# Altium schematic sheet cameralink.SchDoc
size A4; SheetNumber: 2; SheetTotal: 4
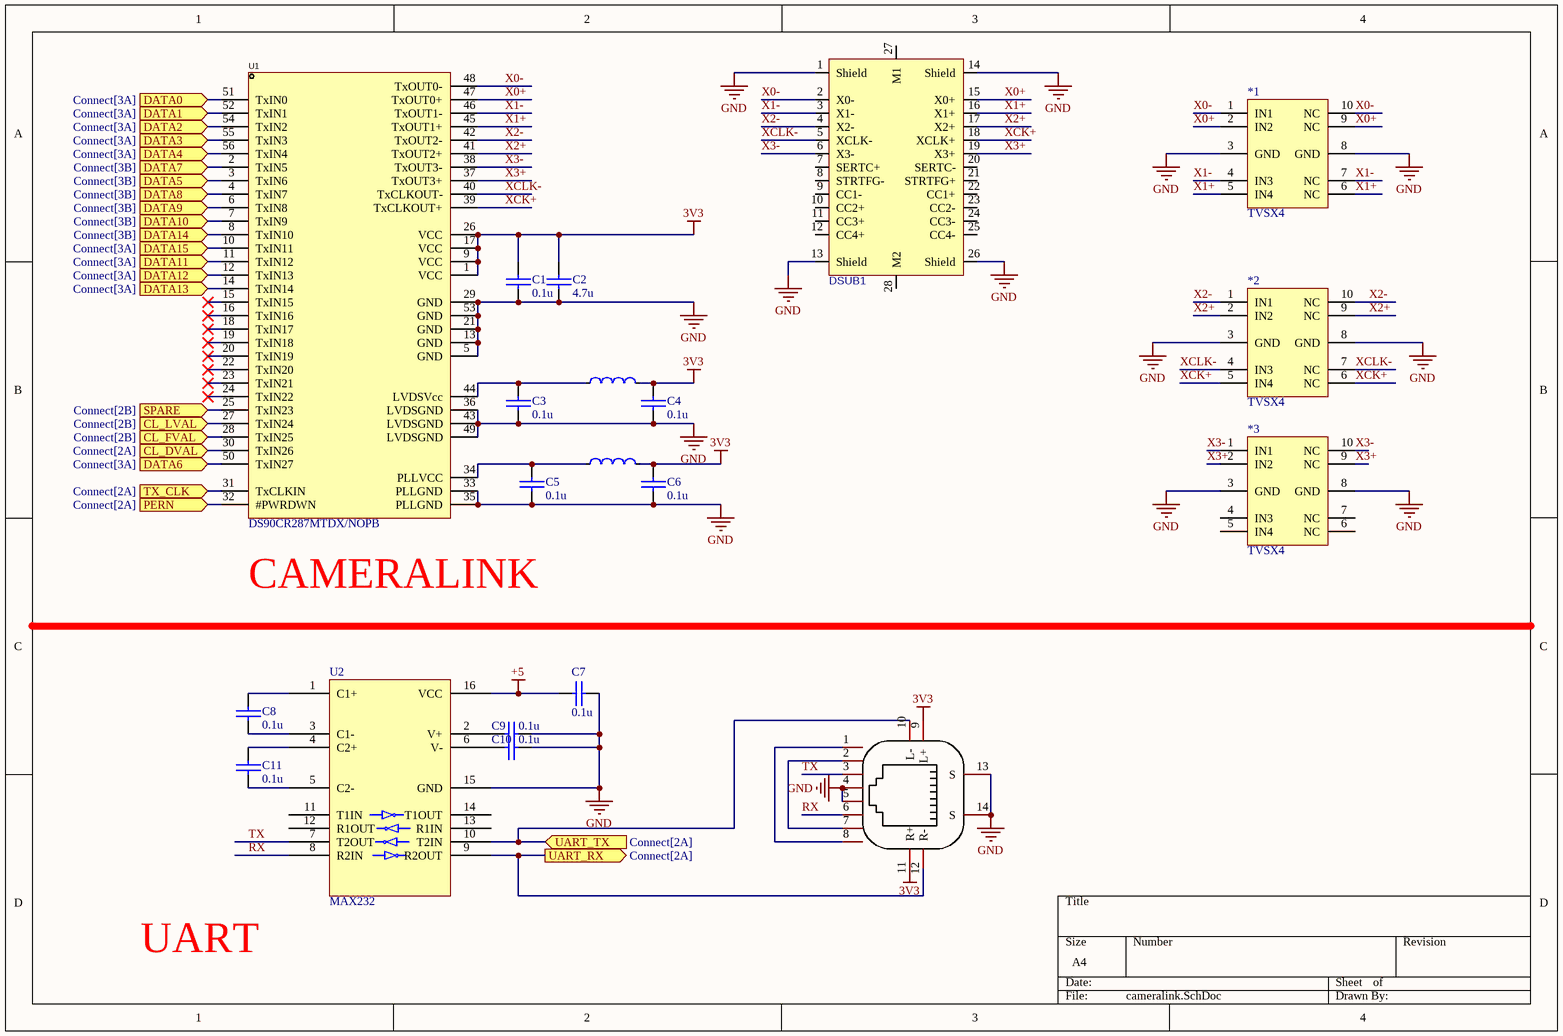
[diagram p0: cameralink.SchDoc]

## Parts
*1  TVSX4  [DFN-10]
*2  TVSX4  [DFN-10]
*3  TVSX4  [DFN-10]
C1  0.1u  [0603C]
C2  4.7u  [0603C]
C3  0.1u  [0603C]
C4  0.1u  [0603C]
C5  0.1u  [0603C]
C6  0.1u  [0603C]
C7  0.1u  [0603C]
C8  0.1u  [0603C]
C9  0.1u  [0603C]
C10  0.1u  [0603C]
C11  0.1u  [0603C]
DSUB1  6321-026RDS1MWA02  [MDR-26-horizontal]  (value not drawn)
L1  GZ1608D601TF  [0603L]  (value not drawn)
L2  GZ1608D601TF  [0603L]  (value not drawn)
RJ1  R-RJ45R08P-C000  [RJ45-TH_R-RJ45R08P-C000]  (value not drawn)
U1  DS90CR287MTDX/NOPB  [TSSOP-56_L14.0-W6.1-P0.50-LS8.1-BL]
U2  MAX232  [SOP16]

## Ports
CL_DVAL (in, see Connect[2A]), CL_FVAL (in, see Connect[2B]), CL_LVAL (in, see Connect[2B]), DATA0 (in, see Connect[3A]), DATA1 (in, see Connect[3A]), DATA2 (in, see Connect[3A]), DATA3 (in, see Connect[3A]), DATA4 (in, see Connect[3A]), DATA5 (in, see Connect[3B]), DATA6 (in, see Connect[3A]), DATA7 (in, see Connect[3B]), DATA8 (in, see Connect[3B]), DATA9 (in, see Connect[3B]), DATA10 (in, see Connect[3B]), DATA11 (in, see Connect[3A]), DATA12 (in, see Connect[3A]), DATA13 (in, see Connect[3A]), DATA14 (in, see Connect[3B]), DATA15 (in, see Connect[3A]), PERN (in, see Connect[2A]), SPARE (in, see Connect[2B]), TX_CLK (in, see Connect[2A]), UART_RX (out, see Connect[2A]), UART_TX (in, see Connect[2A])

## Nets
3V3: C1.2 C2.2 C4.2 C6.2 L1.2 L2.2 RJ1.9(L+) RJ1.11(R+) U1.1(VCC) U1.9(VCC) U1.17(VCC) U1.26(VCC)
+5: C7.2 U2.16(VCC)
GND: *1.3(GND) *1.8(GND) *2.3(GND) *2.8(GND) *3.3(GND) *3.8(GND) C1.1 C2.1 C3.1 C4.1 C5.1 C6.1 C7.1 C9.1 C10.1 DSUB1.1(Shield) DSUB1.13(Shield) DSUB1.14(Shield) DSUB1.26(Shield) RJ1.4 RJ1.5 RJ1.13(S) RJ1.14(S) U1.5(GND) U1.13(GND) U1.21(GND) U1.29(GND) U1.33(PLLGND) U1.35(PLLGND) U1.36(LVDSGND) U1.43(LVDSGND) U1.49(LVDSGND) U1.53(GND) U2.15(GND)
CL_DVAL: U1.30(TxIN26) ; port CL_DVAL
CL_FVAL: U1.28(TxIN25) ; port CL_FVAL
CL_LVAL: U1.27(TxIN24) ; port CL_LVAL
DATA0: U1.51(TxIN0) ; port DATA0
DATA1: U1.52(TxIN1) ; port DATA1
DATA2: U1.54(TxIN2) ; port DATA2
DATA3: U1.55(TxIN3) ; port DATA3
DATA4: U1.56(TxIN4) ; port DATA4
DATA5: U1.3(TxIN6) ; port DATA5
DATA6: U1.50(TxIN27) ; port DATA6
DATA7: U1.2(TxIN5) ; port DATA7
DATA8: U1.4(TxIN7) ; port DATA8
DATA9: U1.6(TxIN8) ; port DATA9
DATA10: U1.7(TxIN9) ; port DATA10
DATA11: U1.11(TxIN12) ; port DATA11
DATA12: U1.12(TxIN13) ; port DATA12
DATA13: U1.14(TxIN14) ; port DATA13
DATA14: U1.8(TxIN10) ; port DATA14
DATA15: U1.10(TxIN11) ; port DATA15
PERN: U1.32(#PWRDWN) ; port PERN
RX: RJ1.6 U2.8(R2IN)
SPARE: U1.25(TxIN23) ; port SPARE
TX: RJ1.3 U2.7(T2OUT)
TX_CLK: U1.31(TxCLKIN) ; port TX_CLK
UART_RX: RJ1.12(R-) U2.9(R2OUT) ; port UART_RX
UART_TX: RJ1.10(L-) U2.10(T2IN) ; port UART_TX
X0+: *1.2(IN2) *1.9(NC) DSUB1.15(X0+) U1.47(TxOUT0+)
X0-: *1.1(IN1) *1.10(NC) DSUB1.2(X0-) U1.48(TxOUT0-)
X1+: *1.5(IN4) *1.6(NC) DSUB1.16(X1+) U1.45(TxOUT1+)
X1-: *1.4(IN3) *1.7(NC) DSUB1.3(X1-) U1.46(TxOUT1-)
X2+: *2.2(IN2) *2.9(NC) DSUB1.17(X2+) U1.41(TxOUT2+)
X2-: *2.1(IN1) *2.10(NC) DSUB1.4(X2-) U1.42(TxOUT2-)
X3+: *3.2(IN2) *3.9(NC) DSUB1.19(X3+) U1.37(TxOUT3+)
X3-: *3.1(IN1) *3.10(NC) DSUB1.6(X3-) U1.38(TxOUT3-)
XCK+: *2.5(IN4) *2.6(NC) DSUB1.18(XCLK+) U1.39(TxCLKOUT+)
XCLK-: *2.4(IN3) *2.7(NC) DSUB1.5(XCLK-) U1.40(TxCLKOUT-)
NetC3_2: C3.2 L1.1 U1.44(LVDSVcc)
NetC5_2: C5.2 L2.1 U1.34(PLLVCC)
NetC8_1: C8.1 U2.3(C1-)
NetC8_2: C8.2 U2.1(C1+)
NetC9_2: C9.2 U2.2(V+)
NetC10_2: C10.2 U2.6(V-)
NetC11_1: C11.1 U2.5(C2-)
NetC11_2: C11.2 U2.4(C2+)
NetRJ1_1: RJ1.1 RJ1.8
NetRJ1_2: RJ1.2 RJ1.7

Not connected (* = marked no-connect by the designer): *3 4(IN3) 5(IN4) 6(NC) 7(NC); DSUB1 7(SERTC+) 8(STRTFG-) 9(CC1-) 10(CC2+) 11(CC3+) 12(CC4+) 20(SERTC-) 21(STRTFG+) 22(CC1+) 23(CC2-) 24(CC3-) 25(CC4-) 27(M1) 28(M2); U1 15(TxIN15)* 16(TxIN16)* 18(TxIN17)* 19(TxIN18)* 20(TxIN19)* 22(TxIN20)* 23(TxIN21)* 24(TxIN22)*; U2 11(T1IN) 12(R1OUT) 13(R1IN) 14(T1OUT)

## Notes on the sheet
- (near U1) CAMERALINK
- UART

## Library data of the parts
*1-*3 = TVSX4: 瞬态抑制二极管
C1-C11 = CAP: 无极性电容
DSUB1 = MDR-26: BOM_Manufacturer: Wcon; Contributor: LCSC; BOM_Supplier: LCSC; BOM_Supplier Part: C843200; BOM_Manufacturer Part: 6321-026RDS1MWA02; BOM_JLCPCB Part Class: Extended Part; spicePre: D; spiceSymbolName: 6321-026RDS1MWA02
L1 L2 = FB: 铁氧体磁珠; Manufacturer: Sunlord(顺络); Add into BOM: yes; Impedance @ Frequency: 600Ω@100MHz; Tolerance: ±25%; DC Resistance: 450mΩ; Current Rating: 200mA; Circuits: 1; Name: GZ1608D601TF; Symbol: GZ1608D601TF; Device: GZ1608D601TF; LCSC Part Name: 600Ω@100MHz ±25%; Supplier Part: C1002; Manufacturer Part: GZ1608D601TF; Supplier Footprint: 0603; JLCPCB Part Class: Basic Part; Datasheet: https://atta.szlcsc.com/upload/public/pdf/source/20210830/355EA7C0FAC5394FC0FE3F17C770C20A.pdf; Supplier: LCSC; Convert to PCB: yes
RJ1 = RJ45R08P: RJ45; Manufacturer: Ckmtw(灿科盟); Add into BOM: yes; Connector Type: RJ插座; Number of Ports: 1; Shielding: 有; LED: 带LED; Name: R-RJ45R08P-C000; Symbol: R-RJ45R08P-C000; Device: R-RJ45R08P-C000; LCSC Part Name: RJ45 弯插 带LED 8P/8C 铜壳带屏蔽 短体  无弹片; Supplier Part: C386757; Manufacturer Part: R-RJ45R08P-C000; Supplier Footprint: 插件; JLCPCB Part Class: Extended Part; Datasheet: https://atta.szlcsc.com/upload/public/pdf/source/20190508/C386757_590BCC8A33AAEEF7838490D656B2E4CF.pdf; Supplier: LCSC; Convert to PCB: yes; USOC Codes: RJ45; Ratings: -; Mounting Style: 弯插; Operating Temperature Range: 0℃~+70℃
U1 = DS90CR287MTDX/NOPB: cameralink编码; Manufacturer: TI(德州仪器); Add into BOM: yes; Name: DS90CR287MTDX/NOPB; Symbol: DS90CR287MTDX/NOPB; Device: DS90CR287MTDX/NOPB; LCSC Part Name: DS90CR287MTDX/NOPB; Supplier Part: C87059; Manufacturer Part: DS90CR287MTDX/NOPB; Supplier Footprint: TSSOP-56; JLCPCB Part Class: Extended Part; Datasheet: https://atta.szlcsc.com/upload/public/pdf/source/20181012/C87059_649258B21BE4DAB0D862C5E1E6C719D7.pdf; Supplier: LCSC; Convert to PCB: yes